# Altium schematic sheet Barracuda3D - System.SchDoc
size B
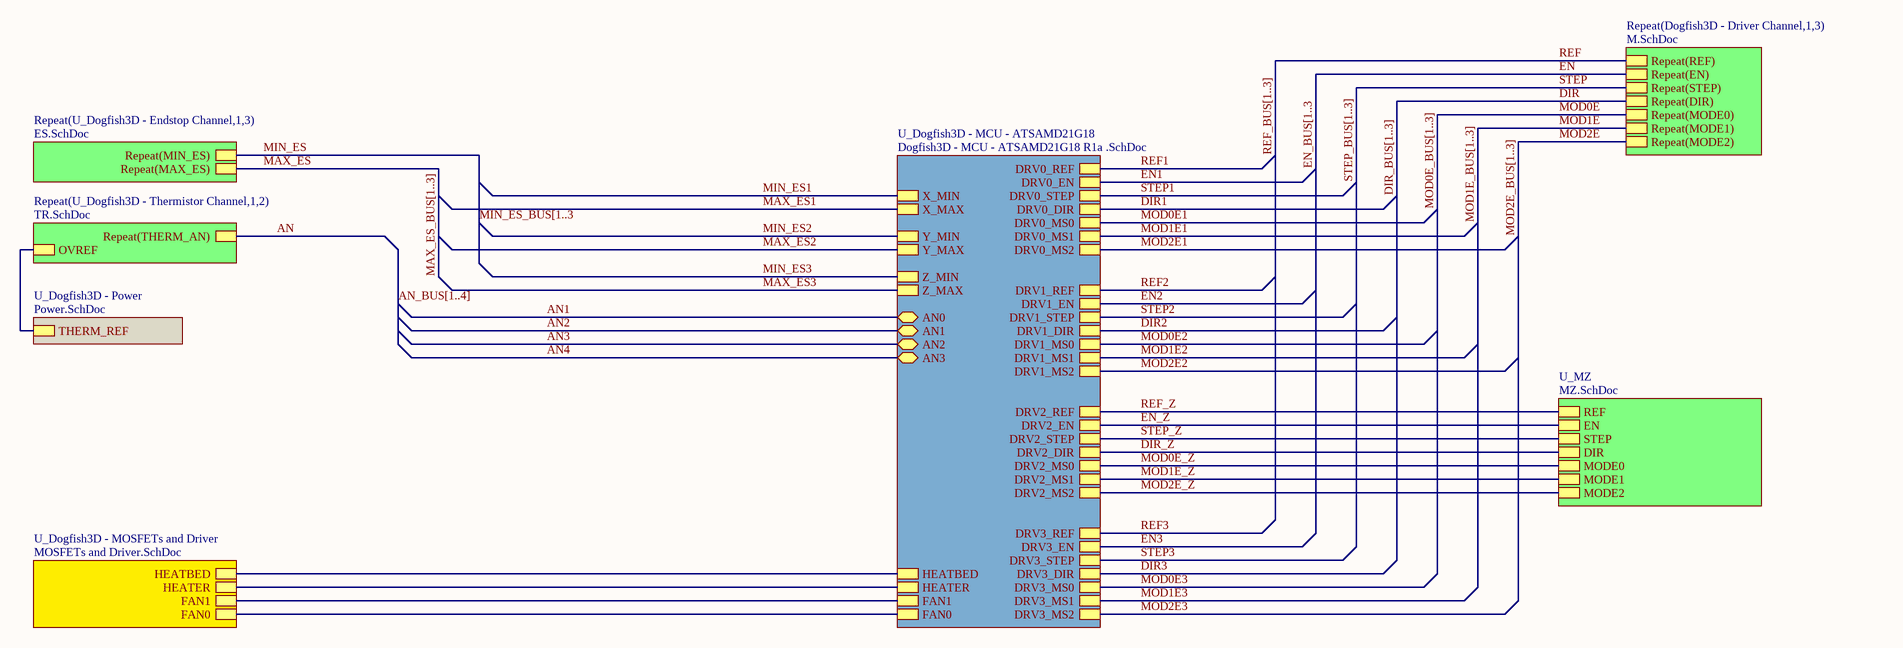
[diagram p0: Barracuda3D - System.SchDoc]

## Sub-sheets
Repeat(Dogfish3D - Driver Channel,1,3) = M.SchDoc: Repeat(REF), Repeat(EN), Repeat(STEP), Repeat(DIR), Repeat(MODE0), Repeat(MODE1), Repeat(MODE2)
Repeat(U_Dogfish3D - Endstop Channel,1,3) = ES.SchDoc: Repeat(MAX_ES), Repeat(MIN_ES)
Repeat(U_Dogfish3D - Thermistor Channel,1,2) = TR.SchDoc: OVREF, Repeat(THERM_AN)
U_Dogfish3D - MCU - ATSAMD21G18 = Dogfish3D - MCU - ATSAMD21G18 R1a .SchDoc: DRV0_EN, DRV0_DIR, DRV0_STEP, DRV0_MS0, DRV0_MS1, DRV0_MS2, DRV0_REF, DRV1_EN, DRV1_DIR, DRV1_STEP, DRV1_MS0, DRV1_MS1, DRV1_MS2, DRV1_REF, DRV2_EN, DRV2_DIR, DRV2_STEP, DRV2_MS0, DRV2_MS1, DRV2_MS2, DRV2_REF, DRV3_EN, DRV3_DIR, DRV3_STEP, DRV3_MS0, DRV3_MS1, DRV3_MS2, DRV3_REF, X_MAX, X_MIN, Y_MAX, Y_MIN, Z_MAX, Z_MIN, FAN0, FAN1, HEATER, HEATBED, AN0, AN1, AN2, AN3
U_Dogfish3D - MOSFETs and Driver = MOSFETs and Driver.SchDoc: FAN0, FAN1, HEATER, HEATBED
U_Dogfish3D - Power = Power.SchDoc: THERM_REF
U_MZ = MZ.SchDoc: REF, EN, STEP, DIR, MODE0, MODE1, MODE2

## Nets
AN: sheet Repeat(U_Dogfish3D - Thermistor Channel,1,2)/Repeat(THERM_AN)
AN1: sheet U_Dogfish3D - MCU - ATSAMD21G18/AN0
AN2: sheet U_Dogfish3D - MCU - ATSAMD21G18/AN1
AN3: sheet U_Dogfish3D - MCU - ATSAMD21G18/AN2
AN4: sheet U_Dogfish3D - MCU - ATSAMD21G18/AN3
DIR: sheet Repeat(Dogfish3D - Driver Channel,1,3)/Repeat(DIR)
DIR1: sheet U_Dogfish3D - MCU - ATSAMD21G18/DRV0_DIR
DIR2: sheet U_Dogfish3D - MCU - ATSAMD21G18/DRV1_DIR
DIR3: sheet U_Dogfish3D - MCU - ATSAMD21G18/DRV3_DIR
DIR_Z: sheet U_Dogfish3D - MCU - ATSAMD21G18/DRV2_DIR, sheet U_MZ/DIR
EN: sheet Repeat(Dogfish3D - Driver Channel,1,3)/Repeat(EN)
EN1: sheet U_Dogfish3D - MCU - ATSAMD21G18/DRV0_EN
EN2: sheet U_Dogfish3D - MCU - ATSAMD21G18/DRV1_EN
EN3: sheet U_Dogfish3D - MCU - ATSAMD21G18/DRV3_EN
EN_Z: sheet U_Dogfish3D - MCU - ATSAMD21G18/DRV2_EN, sheet U_MZ/EN
MAX_ES: sheet Repeat(U_Dogfish3D - Endstop Channel,1,3)/Repeat(MAX_ES)
MAX_ES1: sheet U_Dogfish3D - MCU - ATSAMD21G18/X_MAX
MAX_ES2: sheet U_Dogfish3D - MCU - ATSAMD21G18/Y_MAX
MAX_ES3: sheet U_Dogfish3D - MCU - ATSAMD21G18/Z_MAX
MIN_ES: sheet Repeat(U_Dogfish3D - Endstop Channel,1,3)/Repeat(MIN_ES)
MIN_ES1: sheet U_Dogfish3D - MCU - ATSAMD21G18/X_MIN
MIN_ES2: sheet U_Dogfish3D - MCU - ATSAMD21G18/Y_MIN
MIN_ES3: sheet U_Dogfish3D - MCU - ATSAMD21G18/Z_MIN
MOD0E: sheet Repeat(Dogfish3D - Driver Channel,1,3)/Repeat(MODE0)
MOD0E1: sheet U_Dogfish3D - MCU - ATSAMD21G18/DRV0_MS0
MOD0E2: sheet U_Dogfish3D - MCU - ATSAMD21G18/DRV1_MS0
MOD0E3: sheet U_Dogfish3D - MCU - ATSAMD21G18/DRV3_MS0
MOD0E_Z: sheet U_Dogfish3D - MCU - ATSAMD21G18/DRV2_MS0, sheet U_MZ/MODE0
MOD1E: sheet Repeat(Dogfish3D - Driver Channel,1,3)/Repeat(MODE1)
MOD1E1: sheet U_Dogfish3D - MCU - ATSAMD21G18/DRV0_MS1
MOD1E2: sheet U_Dogfish3D - MCU - ATSAMD21G18/DRV1_MS1
MOD1E3: sheet U_Dogfish3D - MCU - ATSAMD21G18/DRV3_MS1
MOD1E_Z: sheet U_Dogfish3D - MCU - ATSAMD21G18/DRV2_MS1, sheet U_MZ/MODE1
MOD2E: sheet Repeat(Dogfish3D - Driver Channel,1,3)/Repeat(MODE2)
MOD2E1: sheet U_Dogfish3D - MCU - ATSAMD21G18/DRV0_MS2
MOD2E2: sheet U_Dogfish3D - MCU - ATSAMD21G18/DRV1_MS2
MOD2E3: sheet U_Dogfish3D - MCU - ATSAMD21G18/DRV3_MS2
MOD2E_Z: sheet U_Dogfish3D - MCU - ATSAMD21G18/DRV2_MS2, sheet U_MZ/MODE2
REF: sheet Repeat(Dogfish3D - Driver Channel,1,3)/Repeat(REF)
REF1: sheet U_Dogfish3D - MCU - ATSAMD21G18/DRV0_REF
REF2: sheet U_Dogfish3D - MCU - ATSAMD21G18/DRV1_REF
REF3: sheet U_Dogfish3D - MCU - ATSAMD21G18/DRV3_REF
REF_Z: sheet U_Dogfish3D - MCU - ATSAMD21G18/DRV2_REF, sheet U_MZ/REF
STEP: sheet Repeat(Dogfish3D - Driver Channel,1,3)/Repeat(STEP)
STEP1: sheet U_Dogfish3D - MCU - ATSAMD21G18/DRV0_STEP
STEP2: sheet U_Dogfish3D - MCU - ATSAMD21G18/DRV1_STEP
STEP3: sheet U_Dogfish3D - MCU - ATSAMD21G18/DRV3_STEP
STEP_Z: sheet U_Dogfish3D - MCU - ATSAMD21G18/DRV2_STEP, sheet U_MZ/STEP
(unnamed): sheet U_Dogfish3D - MOSFETs and Driver/FAN0, sheet U_Dogfish3D - MCU - ATSAMD21G18/FAN0
(unnamed): sheet U_Dogfish3D - MOSFETs and Driver/FAN1, sheet U_Dogfish3D - MCU - ATSAMD21G18/FAN1
(unnamed): sheet U_Dogfish3D - MOSFETs and Driver/HEATER, sheet U_Dogfish3D - MCU - ATSAMD21G18/HEATER
(unnamed): sheet U_Dogfish3D - MOSFETs and Driver/HEATBED, sheet U_Dogfish3D - MCU - ATSAMD21G18/HEATBED
(unnamed): sheet U_Dogfish3D - Power/THERM_REF, sheet Repeat(U_Dogfish3D - Thermistor Channel,1,2)/OVREF

## Buses and harness runs
bus AN_BUS[1..4]
bus DIR_BUS[1..3]
bus EN_BUS[1..3
bus MAX_ES_BUS[1..3]
bus MIN_ES_BUS[1..3
bus MOD0E_BUS[1..3]
bus MOD1E_BUS[1..3]
bus MOD2E_BUS[1..3]
bus REF_BUS[1..3]
bus STEP_BUS[1..3]